# Altium schematic sheet Main.SchDoc
size A4; SheetNumber: 1; SheetTotal: 11
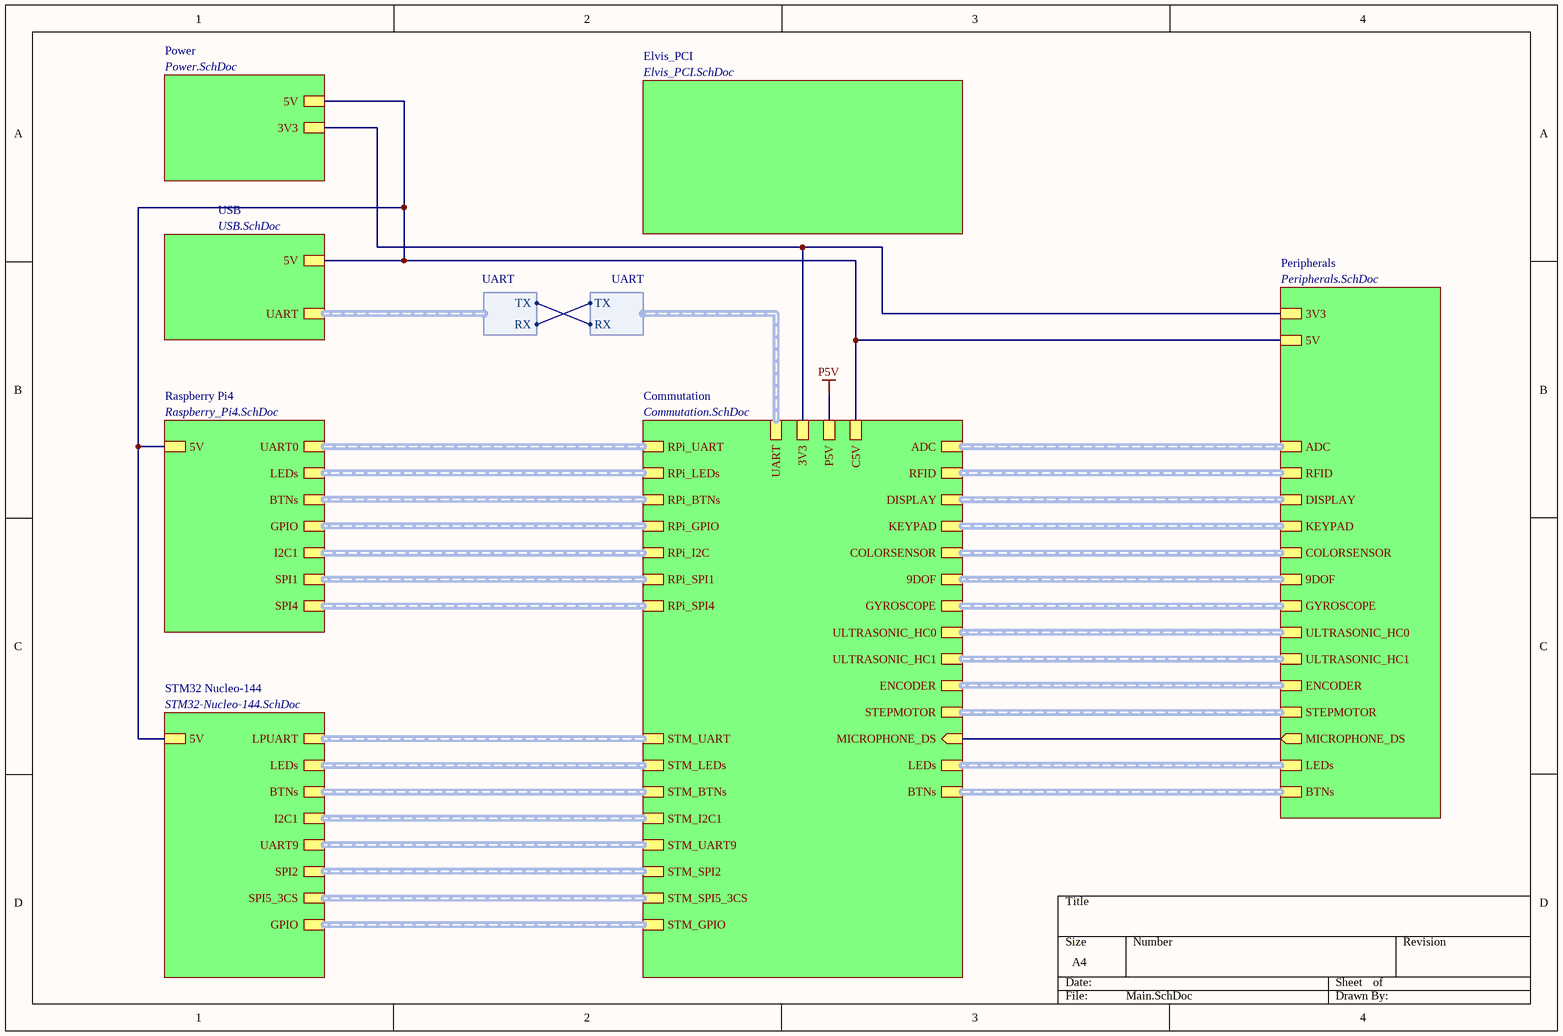
[diagram p0: Main.SchDoc]

## Sub-sheets
Commutation = Commutation.SchDoc: RPi_I2C (harness I2C), GYROSCOPE (harness GY-50 L3GD20 Gyro), STEPMOTOR (harness ULN2003 Module), DISPLAY (harness MSP3520), UART (harness UART), RPi_UART (harness UART), STM_UART (harness UART), MICROPHONE_DS (in), RPi_BTNs (harness BUTTONS), STM_BTNs (harness BUTTONS), BTNs (harness BUTTONS), RPi_LEDs (harness LEDS), LEDs (harness LEDS), STM_LEDs (harness LEDS), RPi_SPI4 (harness SPI_2CS), RPi_GPIO (harness RPi_GPIO), ADC (harness ADS1115 module), ULTRASONIC_HC0 (harness HC-SR04), ULTRASONIC_HC1 (harness HC-SR04), KEYPAD (harness Keypad COM-08653), RPi_SPI1 (harness SPI_3CS), RFID (harness RC522), STM_UART9 (harness UART), STM_SPI5_3CS (harness SPI_3CS), STM_I2C1 (harness I2C), STM_SPI2 (harness SPI), STM_GPIO (harness STM32_GPIO), 3V3, P5V, C5V, 9DOF (harness 9DOF), COLORSENSOR (harness TCS34725), ENCODER (harness KY-040)
Elvis_PCI = Elvis_PCI.SchDoc: no entries
Peripherals = Peripherals.SchDoc: 3V3, RFID (harness RC522), 5V, STEPMOTOR (harness ULN2003 Module), GYROSCOPE (harness GY-50 L3GD20 Gyro), MICROPHONE_DS (out), DISPLAY (harness MSP3520), BTNs (harness BUTTONS), ADC (harness ADS1115 module), LEDs (harness LEDS), ULTRASONIC_HC1 (harness HC-SR04), ULTRASONIC_HC0 (harness HC-SR04), KEYPAD (harness Keypad COM-08653), 9DOF (harness 9DOF), COLORSENSOR (harness TCS34725), ENCODER (harness KY-040)
Power = Power.SchDoc: 3V3, 5V
Raspberry Pi4 = Raspberry_Pi4.SchDoc: I2C1 (harness I2C), UART0 (harness UART), BTNs (harness BUTTONS), LEDs (harness LEDS), SPI4 (harness SPI_2CS), GPIO (harness RPI_GPIO), 5V, SPI1 (harness SPI_3CS)
STM32 Nucleo-144 = STM32-Nucleo-144.SchDoc: LEDs (harness LEDS), LPUART (harness UART), BTNs (harness BUTTONS), UART9 (harness UART), SPI2 (harness SPI), I2C1 (harness I2C), SPI5_3CS (harness SPI_3CS), GPIO (harness STM32_GPIO), 5V
USB = USB.SchDoc: UART (harness UART), 5V

## Harnesses
UART: TX, RX

## Nets
P5V: sheet Commutation/P5V
(unnamed): sheet Power/3V3, sheet Commutation/3V3, sheet Peripherals/3V3
(unnamed): sheet Power/5V, sheet Raspberry Pi4/5V, sheet Commutation/C5V, sheet USB/5V, sheet Peripherals/5V, sheet STM32 Nucleo-144/5V
(unnamed): sheet Commutation/MICROPHONE_DS, sheet Peripherals/MICROPHONE_DS
(unnamed): sheet USB/UART.TX, sheet Commutation/UART.RX
(unnamed): sheet USB/UART.RX, sheet Commutation/UART.TX

## Buses and harness runs
harness sheet Commutation/9DOF = sheet Peripherals/9DOF
harness sheet Commutation/ADC = sheet Peripherals/ADC
harness sheet Commutation/BTNs = sheet Peripherals/BTNs
harness sheet Commutation/COLORSENSOR = sheet Peripherals/COLORSENSOR
harness sheet Commutation/DISPLAY = sheet Peripherals/DISPLAY
harness sheet Commutation/ENCODER = sheet Peripherals/ENCODER
harness sheet Commutation/GYROSCOPE = sheet Peripherals/GYROSCOPE
harness sheet Commutation/KEYPAD = sheet Peripherals/KEYPAD
harness sheet Commutation/LEDs = sheet Peripherals/LEDs
harness sheet Commutation/RFID = sheet Peripherals/RFID
harness sheet Commutation/RPi_BTNs = sheet Raspberry Pi4/BTNs
harness sheet Commutation/RPi_GPIO = sheet Raspberry Pi4/GPIO
harness sheet Commutation/RPi_I2C = sheet Raspberry Pi4/I2C1
harness sheet Commutation/RPi_LEDs = sheet Raspberry Pi4/LEDs
harness sheet Commutation/RPi_SPI1 = sheet Raspberry Pi4/SPI1
harness sheet Commutation/RPi_SPI4 = sheet Raspberry Pi4/SPI4
harness sheet Commutation/RPi_UART = sheet Raspberry Pi4/UART0
harness sheet Commutation/STEPMOTOR = sheet Peripherals/STEPMOTOR
harness sheet Commutation/STM_BTNs = sheet STM32 Nucleo-144/BTNs
harness sheet Commutation/STM_GPIO = sheet STM32 Nucleo-144/GPIO
harness sheet Commutation/STM_I2C1 = sheet STM32 Nucleo-144/I2C1
harness sheet Commutation/STM_LEDs = sheet STM32 Nucleo-144/LEDs
harness sheet Commutation/STM_SPI2 = sheet STM32 Nucleo-144/SPI2
harness sheet Commutation/STM_SPI5_3CS = sheet STM32 Nucleo-144/SPI5_3CS
harness sheet Commutation/STM_UART9 = sheet STM32 Nucleo-144/UART9
harness sheet Commutation/STM_UART = sheet STM32 Nucleo-144/LPUART
harness sheet Commutation/ULTRASONIC_HC0 = sheet Peripherals/ULTRASONIC_HC0
harness sheet Commutation/ULTRASONIC_HC1 = sheet Peripherals/ULTRASONIC_HC1